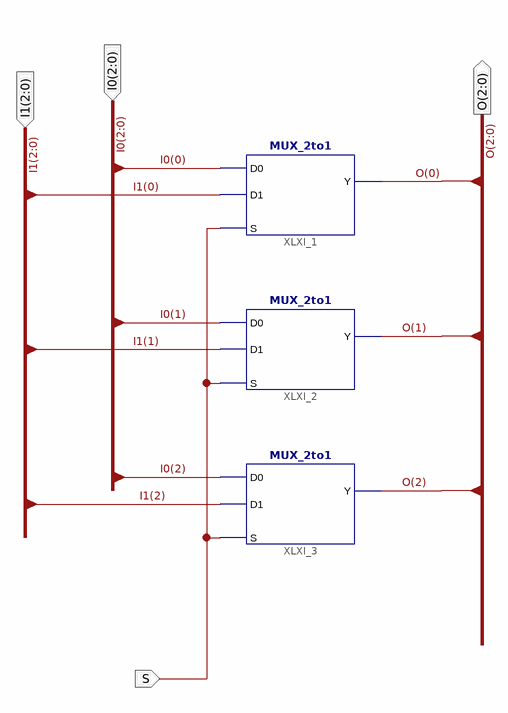
[diagram p0: schematic sheet 1]
// Xilinx ISE schematic MUX_2Way_3Bit.sch (spartan3e) as structural Verilog: 3 symbols, 4 ports
module MUX_2Way_3Bit (
  input  S,
  input  [2:0] I0,
  input  [2:0] I1,
  output [2:0] O
);

  MUX_2to1 XLXI_1 (.D0(I0[0]), .S(S), .D1(I1[0]), .Y(O[0]));
  MUX_2to1 XLXI_2 (.D0(I0[1]), .S(S), .D1(I1[1]), .Y(O[1]));
  MUX_2to1 XLXI_3 (.D0(I0[2]), .S(S), .D1(I1[2]), .Y(O[2]));
endmodule
